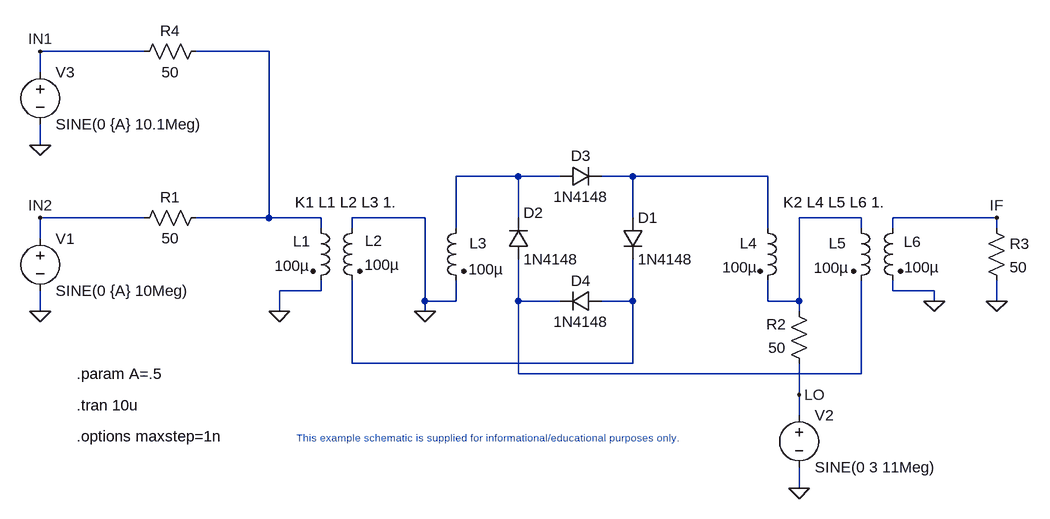
[diagram p0: schematic m.asc]
m.asc, the LTspice schematic file:
Version 4
SHEET 1 3500 2516
WIRE 1952 1824 1792 1824
WIRE 2144 1824 2032 1824
WIRE 1792 1856 1792 1824
WIRE 1792 1968 1792 1936
WIRE 2528 2016 2432 2016
WIRE 2592 2016 2528 2016
WIRE 2704 2016 2656 2016
WIRE 2912 2016 2704 2016
WIRE 1952 2080 1792 2080
WIRE 2144 2080 2144 1824
WIRE 2144 2080 2032 2080
WIRE 2224 2080 2144 2080
WIRE 2384 2080 2272 2080
WIRE 2528 2080 2528 2016
WIRE 2704 2080 2704 2016
WIRE 3056 2080 2960 2080
WIRE 3264 2080 3104 2080
WIRE 2224 2096 2224 2080
WIRE 2272 2096 2272 2080
WIRE 2432 2096 2432 2016
WIRE 2912 2096 2912 2016
WIRE 3056 2096 3056 2080
WIRE 3104 2096 3104 2080
WIRE 3264 2096 3264 2080
WIRE 1792 2112 1792 2080
WIRE 2224 2192 2224 2176
WIRE 2224 2192 2160 2192
WIRE 3104 2192 3104 2176
WIRE 3168 2192 3104 2192
WIRE 2384 2208 2384 2080
WIRE 2432 2208 2432 2176
WIRE 2432 2208 2384 2208
WIRE 2528 2208 2528 2144
WIRE 2592 2208 2528 2208
WIRE 2704 2208 2704 2144
WIRE 2704 2208 2656 2208
WIRE 2912 2208 2912 2176
WIRE 2960 2208 2960 2080
WIRE 2960 2208 2912 2208
WIRE 3168 2208 3168 2192
WIRE 3264 2208 3264 2176
WIRE 1792 2224 1792 2192
WIRE 2160 2224 2160 2192
WIRE 2384 2224 2384 2208
WIRE 2960 2224 2960 2208
WIRE 2272 2304 2272 2176
WIRE 2704 2304 2704 2208
WIRE 2704 2304 2272 2304
WIRE 2528 2320 2528 2208
WIRE 3056 2320 3056 2176
WIRE 3056 2320 2528 2320
WIRE 2960 2352 2960 2304
WIRE 2960 2384 2960 2352
WIRE 2960 2496 2960 2464
FLAG 1792 2224 0
FLAG 2384 2224 0
FLAG 3168 2208 0
FLAG 3264 2208 0
FLAG 2160 2224 0
FLAG 2960 2496 0
FLAG 1792 2080 IN2
FLAG 2960 2352 LO
FLAG 3264 2080 IF
FLAG 1792 1968 0
FLAG 1792 1824 IN1
SYMBOL VOLTAGE 1792 2096 R0
SYMATTR InstName V1
SYMATTR Value SINE(0 {A} 10Meg)
SYMBOL ind2 2288 2080 M0
WINDOW 0 -4 35 Right 2
WINDOW 3 -3 72 Right 2
SYMATTR InstName L2
SYMATTR Value 100µ
SYMBOL ind2 2448 2080 M0
WINDOW 0 -5 39 Right 2
WINDOW 3 -3 79 Right 2
SYMATTR InstName L3
SYMATTR Value 100µ
SYMBOL ind2 2208 2080 R0
WINDOW 0 0 36 Right 2
WINDOW 3 -1 74 Right 2
SYMATTR InstName L1
SYMATTR Value 100µ
SYMBOL diode 2592 2032 R270
WINDOW 0 32 32 VTop 2
WINDOW 3 0 32 VBottom 2
SYMATTR InstName D3
SYMATTR Value 1N4148
SYMBOL diode 2656 2224 M270
WINDOW 0 32 32 VTop 2
WINDOW 3 0 32 VBottom 2
SYMATTR InstName D4
SYMATTR Value 1N4148
SYMBOL ind2 3040 2080 R0
WINDOW 0 -7 39 Right 2
WINDOW 3 -3 77 Right 2
SYMATTR InstName L5
SYMATTR Value 100µ
SYMBOL ind2 2896 2080 R0
WINDOW 0 0 39 Right 2
WINDOW 3 0 76 Right 2
SYMATTR InstName L4
SYMATTR Value 100µ
SYMBOL ind2 3120 2080 M0
WINDOW 0 -1 37 Right 2
WINDOW 3 -2 76 Right 2
SYMATTR InstName L6
SYMATTR Value 100µ
SYMBOL diode 2688 2080 R0
SYMATTR InstName D1
SYMATTR Value 1N4148
SYMBOL diode 2512 2144 M180
WINDOW 0 24 72 Left 2
WINDOW 3 24 0 Left 2
SYMATTR InstName D2
SYMATTR Value 1N4148
SYMBOL VOLTAGE 2960 2368 R0
SYMATTR InstName V2
SYMATTR Value SINE(0 3 11Meg)
SYMBOL res 3248 2080 R0
SYMATTR InstName R3
SYMATTR Value 50
SYMBOL res 2048 2064 R90
WINDOW 0 0 56 VBottom 2
WINDOW 3 32 56 VTop 2
SYMATTR InstName R1
SYMATTR Value 50
SYMBOL res 2976 2320 R180
WINDOW 0 36 76 Left 2
WINDOW 3 36 40 Left 2
SYMATTR InstName R2
SYMATTR Value 50
SYMBOL VOLTAGE 1792 1840 R0
SYMATTR InstName V3
SYMATTR Value SINE(0 {A} 10.1Meg)
SYMBOL res 2048 1808 R90
WINDOW 0 0 56 VBottom 2
WINDOW 3 32 56 VTop 2
SYMATTR InstName R4
SYMATTR Value 50
TEXT 1848 2368 Left 2 !.tran 10u
TEXT 2184 2056 Left 2 !K1 L1 L2 L3 1.
TEXT 2472 2408 Top 1 ;This example schematic is supplied for informational/educational purposes only.
TEXT 2936 2056 Left 2 !K2 L4 L5 L6 1.
TEXT 1848 2320 Left 2 !.param A=.5
TEXT 1848 2416 Left 2 !.options maxstep=1n

The netlist it stands for:
* m.asc
V1 IN2 0 SINE(0 {A} 10Meg)
L2 0 N006 100µ
L3 N002 0 100µ
L1 N001 0 100µ
D3 N002 N003 1N4148
D4 N006 N005 1N4148
L5 N004 N005 100µ
L4 N003 N004 100µ
L6 IF 0 100µ
D1 N003 N006 1N4148
D2 N005 N002 1N4148
V2 LO 0 SINE(0 3 11Meg)
R3 IF 0 50
R1 N001 IN2 50
R2 LO N004 50
V3 IN1 0 SINE(0 {A} 10.1Meg)
R4 N001 IN1 50
.model D D
.lib standard.dio
.tran 10u
K1 L1 L2 L3 1.
* This example schematic is supplied for informational/educational purposes only.
K2 L4 L5 L6 1.
.param A=.5
.options maxstep=1n
.backanno
.end